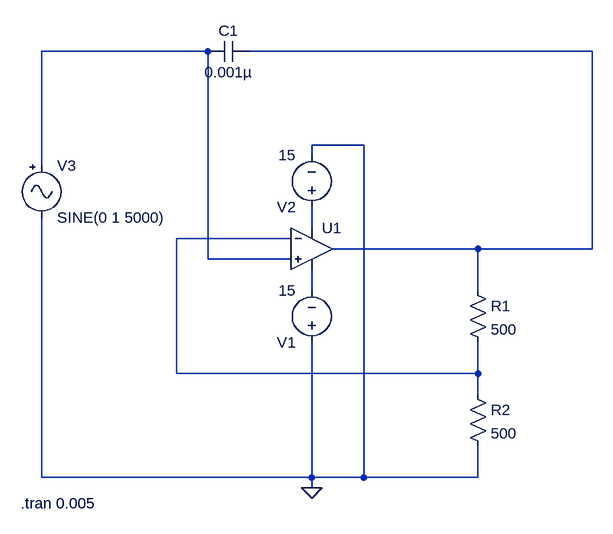
[diagram p0: schematic Negative Impedence.asc]
Negative Impedence.asc, the LTspice schematic file:
Version 4
SHEET 1 880 680
WIRE -416 -432 -672 -432
WIRE 176 -432 -352 -432
WIRE -176 -288 -256 -288
WIRE -256 -272 -256 -288
WIRE -672 -256 -672 -432
WIRE -256 -160 -256 -192
WIRE -288 -144 -464 -144
WIRE 0 -128 -224 -128
WIRE 176 -128 176 -432
WIRE 176 -128 0 -128
WIRE -416 -112 -416 -432
WIRE -288 -112 -416 -112
WIRE -256 -64 -256 -96
WIRE 0 -64 0 -128
WIRE -464 64 -464 -144
WIRE 0 64 0 16
WIRE 0 64 -464 64
WIRE 0 96 0 64
WIRE -672 224 -672 -176
WIRE -256 224 -256 16
WIRE -256 224 -672 224
WIRE -176 224 -176 -288
WIRE -176 224 -256 224
WIRE 0 224 0 176
WIRE 0 224 -176 224
WIRE -256 240 -256 224
FLAG -256 240 0
SYMBOL OpAmps\\UniversalOpamp2 -256 -128 R0
SYMATTR InstName U1
SYMBOL voltage -256 32 R180
WINDOW 123 0 0 Left 0
WINDOW 39 0 0 Left 0
SYMATTR InstName V1
SYMATTR Value 15
SYMBOL voltage -256 -176 R180
WINDOW 123 0 0 Left 0
WINDOW 39 0 0 Left 0
SYMATTR InstName V2
SYMATTR Value 15
SYMBOL res -16 -80 R0
SYMATTR InstName R1
SYMATTR Value 500
SYMBOL res -16 80 R0
SYMATTR InstName R2
SYMATTR Value 500
SYMBOL cap -352 -448 R90
WINDOW 0 0 32 VBottom 2
WINDOW 3 32 32 VTop 2
SYMATTR InstName C1
SYMATTR Value 0.001µ
SYMBOL Misc\\signal -672 -272 R0
WINDOW 123 0 0 Left 0
WINDOW 39 0 0 Left 0
SYMATTR InstName V3
SYMATTR Value SINE(0 1 5000)
TEXT -704 264 Left 2 !.tran 0.005

The netlist it stands for:
* Negative Impedence.asc
XU1 N001 N004 N003 N005 N002 level.2 Avol=1Meg GBW=10Meg Slew=10Meg ilimit=25m rail=0 Vos=0 phimargin=45 en=0 enk=0 in=0 ink=0 Rin=500Meg  ; pins IN+ IN- V+ V- OUT
V1 0 N005 15
V2 N003 0 15
R1 N002 N004 500
R2 N004 0 500
C1 N002 N001 0.001µ
V3 N001 0 SINE(0 1 5000)
.tran 0.005
.lib UniversalOpamps2.sub
.backanno
.end